# Altium schematic sheet AlarmTiming.SchDoc
size Letter; SheetNumber: 1; SheetTotal: 1
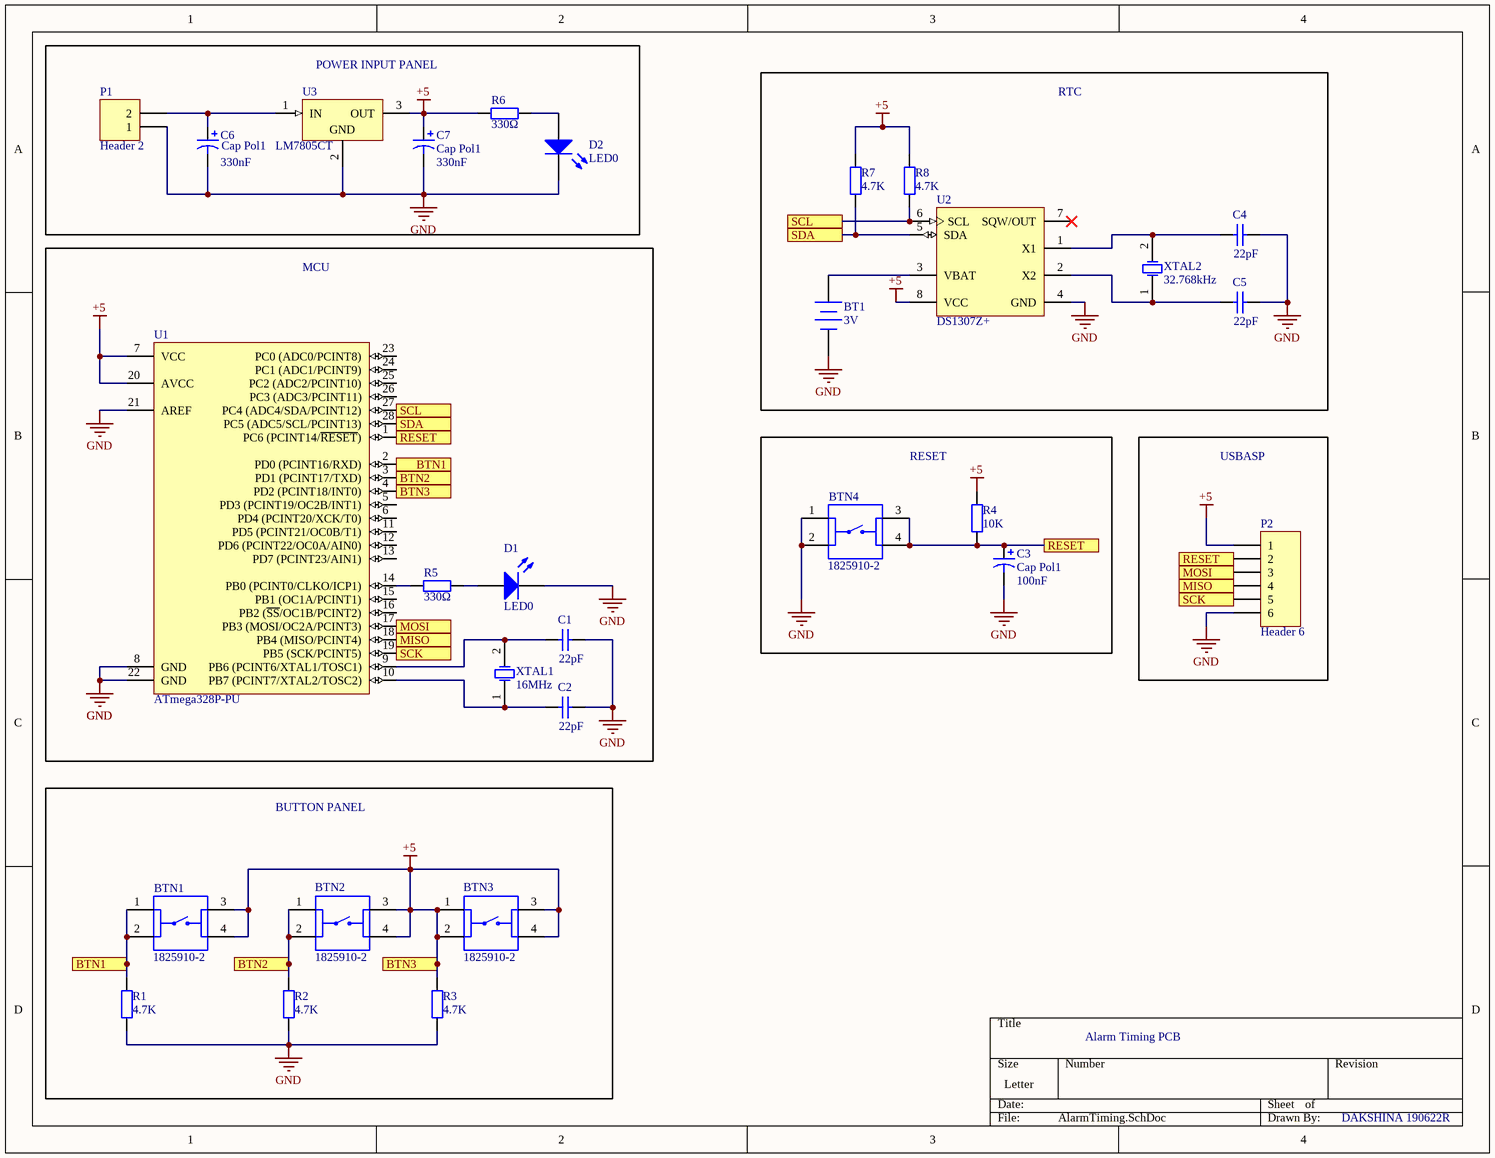
[diagram p0: AlarmTiming.SchDoc]

## Parts
BT1  3V  [BAT-2]
BTN1  1825910-2  [TE_1825910-2]
BTN2  1825910-2  [TE_1825910-2]
BTN3  1825910-2  [TE_1825910-2]
BTN4  1825910-2  [TE_1825910-2]
C1  value 22pF  [RAD-0.3]  (hidden comment: Cap)
C2  value 22pF  [RAD-0.3]  (hidden comment: Cap)
C3  Cap Pol1  value 100nF  [RB7.6-15]
C4  value 22pF  [RAD-0.3]  (hidden comment: Cap)
C5  value 22pF  [RAD-0.3]  (hidden comment: Cap)
C6  Cap Pol1  value 330nF  [RB7.6-15]
C7  Cap Pol1  value 330nF  [RB7.6-15]
D1  LED0  [LED-0]
D2  LED0  [LED-0]
P1  Header 2  [HDR1X2]
P2  Header 6  [HDR1X6]
R1  value 4.7K  [AXIAL-0.4]  (hidden comment: Res2)
R2  value 4.7K  [AXIAL-0.4]  (hidden comment: Res2)
R3  value 4.7K  [AXIAL-0.4]  (hidden comment: Res2)
R4  value 10K  [AXIAL-0.4]  (hidden comment: Res2)
R5  value 330Ω  [AXIAL-0.4]  (hidden comment: Res2)
R6  value 330Ω  [AXIAL-0.4]  (hidden comment: Res2)
R7  value 4.7K  [AXIAL-0.4]  (hidden comment: Res2)
R8  value 4.7K  [AXIAL-0.4]  (hidden comment: Res2)
U1  ATmega328P-PU  [28P3]
U2  DS1307Z+  [S8+2_L]
U3  LM7805CT  [FAIR-TO-220-3]
XTAL1  16MHz  [R38]
XTAL2  32.768kHz  [R38]

## Blocks framed on the sheet
POWER INPUT PANEL: C6 C7 D2 P1 R6 U3
RTC: BT1 C4 C5 R7 R8 U2 XTAL2
MCU: C1 C2 D1 R5 U1 XTAL1
RESET: BTN4 C3 R4
USBASP: P2
BUTTON PANEL: BTN1-BTN3 R1-R3

## Ports
BTN1, BTN2, BTN3, MISO, MOSI, RESET, SCK, SCL, SDA

## Nets
+5: BTN1.3 BTN1.4 BTN2.3 BTN2.4 BTN3.1 BTN3.2 BTN3.3 BTN3.4 C7.1 P2.1 R3.2 R4.2 R6.2 R7.2 R8.2 U1.4(PD2_(PCINT18/INT0)) U1.7(VCC) U1.20(AVCC) U2.8(VCC) U3.3(OUT) ; port BTN3
GND: BT1.2(-) BTN4.1 BTN4.2 C1.2 C2.2 C3.2 C4.2 C5.2 C6.2 C7.2 D1.2(K) D2.2(K) P1.1 P2.6 R1.1 R2.1 R3.1 U1.8(GND) U1.21(AREF) U1.22(GND) U2.4(GND) U3.2(GND)
BTN1: BTN1.1 BTN1.2 R1.2 U1.2(PD0_(PCINT16/RXD)) ; port BTN1
BTN2: BTN2.1 BTN2.2 R2.2 U1.3(PD1_(PCINT17/TXD)) ; port BTN2
MISO: P2.4 U1.18(PB4_(MISO/PCINT4)) ; port MISO
MOSI: P2.3 U1.17(PB3_(MOSI/OC2A/PCINT3)) ; port MOSI
RESET: BTN4.3 BTN4.4 C3.1 P2.2 R4.1 U1.1(PC6_(PCINT14/~{RESET})) ; port RESET
SCK: P2.5 U1.19(PB5_(SCK/PCINT5)) ; port SCK
SCL: R8.1 U1.27(PC4_(ADC4/SDA/PCINT12)) U2.6(SCL) ; port SCL
SDA: R7.1 U1.28(PC5_(ADC5/SCL/PCINT13)) U2.5(SDA) ; port SDA
NetBT1_1: BT1.1(+) U2.3(VBAT)
NetC1_1: C1.1 U1.9(PB6_(PCINT6/XTAL1/TOSC1)) XTAL1.2(OSC2)
NetC2_1: C2.1 U1.10(PB7_(PCINT7/XTAL2/TOSC2)) XTAL1.1(OSC1)
NetC4_1: C4.1 U2.1(X1) XTAL2.2(OSC2)
NetC5_1: C5.1 U2.2(X2) XTAL2.1(OSC1)
NetC6_1: C6.1 P1.2 U3.1(IN)
NetD1_1: D1.1(A) R5.1
NetD2_1: D2.1(A) R6.1
NetR5_2: R5.2 U1.14(PB0_(PCINT0/CLKO/ICP1))

Not connected (* = marked no-connect by the designer): U1 5(PD3_(PCINT19/OC2B/INT1)) 6(PD4_(PCINT20/XCK/T0)) 11(PD5_(PCINT21/OC0B/T1)) 12(PD6_(PCINT22/OC0A/AIN0)) 13(PD7_(PCINT23/AIN1)) 15(PB1_(OC1A/PCINT1)) 16(PB2_(~{SS}/OC1B/PCINT2)) 23(PC0_(ADC0/PCINT8)) 24(PC1_(ADC1/PCINT9)) 25(PC2_(ADC2/PCINT10)) 26(PC3_(ADC3/PCINT11)); U2 7(SQW/OUT)*

## Notes on the sheet
- Alarm Timing PCB
- DAKSHINA 190622R

## Library data of the parts
BT1 = Battery: Multicell Battery; Published: 24-Mar-1999; LatestRevisionDate: 17-Jul-2002; LatestRevisionNote: Re-released for DXP Platform.; PackageReference: BAT-2; Publisher: Altium Limited; PackageDescription: Battery; 2 Leads
BTN1-BTN4 = 1825910-2: 50 mA SPST Round Actuator 160 Gram Force Tactile Pushbutton Switch; Contact_Current_Rating: 50 mA; MF: TE Connectivity; Configuration_Pole-Throw: Single Pole - Single Throw; Availability: Unavailable; MP: 1825910-2; Value: *; Package: None; SnapEDA_Link: https://www.snapeda.com/parts/1825910-2/TE%20Connectivity%20ALCOSWITCH%20Switches/view-part/278983/?ref=snap; TE_purchase_URL: https://www.te.com/usa-en/product-1825910-2.html?te_bu=Cor&te_type=disp&te_campaign=seda_glo_cor-seda-global-disp-prtnr-fy19-seda-model-bom-cta_sma-317_1&elqCampaignId=32493; EU_RoHS_Compliance: Compliant; Price: None
C1 C2 C4 C5 = Cap: Capacitor; Published: 8-Jun-2000; LatestRevisionDate: 17-Jul-2002; LatestRevisionNote: Re-released for DXP Platform.; PackageReference: RAD-0.3; Publisher: Altium Limited; PackageDescription: Radial Cap, Thru-Hole; 2 Leads; 0.3 in Pin Spacing
C3 C6 C7 = Cap Pol1: Polarized Capacitor (Radial); Published: 8-Jun-2000; LatestRevisionDate: 17-Jul-2002; LatestRevisionNote: Re-released for DXP Platform.; PackageReference: RB7.6-15; Publisher: Altium Limited; PackageDescription: Polarized Capacitor (Radial); 2 Leads
D1 D2 = LED0: Typical INFRARED GaAs LED; Published: 8-Jun-2000; LatestRevisionDate: 08-Jul-2005; LatestRevisionNote: Mech Layer 1 removed.; PackageReference: LED-0; Publisher: Altium Limited; PackageDescription: LED; 2 Leads
P1 = Header 2: Header, 2-Pin; LatestRevisionDate: 17-Jul-2002; LatestRevisionNote: Re-released for DXP Platform.; Publisher: Altium Limited
P2 = Header 6: Header, 6-Pin; LatestRevisionDate: 17-Jul-2002; LatestRevisionNote: Re-released for DXP Platform.; Publisher: Altium Limited
R1-R8 = Res2: Resistor; Published: 8-Jun-2000; LatestRevisionDate: 17-Jul-2002; LatestRevisionNote: Re-released for DXP Platform.; PackageReference: AXIAL-0.4; Publisher: Altium Limited; PackageDescription: Axial Device, Thru-Hole; 2 Leads; 0.4 in Pin Spacing
U1 = CMP-0095-00013-2: 8-bit AVR Microcontroller, 32KB Flash, 1KB EEPROM, 2KB SRAM, 28-pin PDIP, Industrial Grade (-40°C to 85°C); RevisionNote: DatasheetVersion updated. URLs added.; PackageVersion: revB, Sep-2001; PackageDescription: 28-lead (0.300"/7.62mm Wide) Plastic Dual Inline Package (PDIP); DatasheetVersion: revD, May-2011; ComponentLink1Description: Manufacturer URL; ComponentLink1URL: http://www.atmel.com/; PackageReference: 28P3; ComponentLink2Description: ATmega48A/48PA/88A/88PA/168A/168PA/328/328P Datasheet; ComponentLink3URL: http://www.atmel.com/dyn/resources/prod_documents/8271S.pdf; ComponentLink2URL: http://www.atmel.com/dyn/resources/prod_documents/8271.pdf; ComponentLink3Description: ATmega48A/48PA/88A/88PA/168A/168PA/328/328P Summary
U2 = CMP-0254-00308-1: 64 x 8, Serial, I2C Real-Time Clock, 5.0V, 8-Pin SO, 0 to 70 degC, Pb-Free; ComponentLink3Description: Package Specification; DatasheetVersion: 10-Feb-2008; Code_IPC: SOIC127P600-8; ComponentLink2Description: Datasheet; Code_JEDEC: MS-012-AA; ComponentLink2URL: http://datasheets.maxim-ic.com/en/ds/DS1307.pdf; ComponentLink3URL: http://pdfserv.maxim-ic.com/package_dwgs/21-0041.PDF; ComponentLink1URL: http://www.maxim-ic.com; PackageReference: S8+2; ComponentLink1Description: Manufacturer URL; PackageDescription: 8-Pin Small-Outline IC, Narrow (0.15in), 1.27 mm Pitch, SOIC (N), Pb-Free; PackageVersion: revC, 2010
U3 = CMP-2000-04938-1: Positive Voltage Regulator, 5 V, 1 A, -40 to 125 degC, 3-Pin TO-220, RoHS, Tube; Manufacturer: FairchildSemiconductor; Maximum Input Voltage: 35V; Maximum Quiescent Current: 8mA; Load Regulation: 100mV; Maximum Output Current: 2.2(Typ)A; Output Type: Fixed; Typical Dropout Voltage @ Current: 2@1AV; Rad Hard: No; Output Voltage: 5V; Accuracy: ±4%; Number of Outputs: 1; Category: LinearRegulator; Package Description: 3-Pin Through Hole Device, Body 10 x 4.5 mm, Pitch 2.54 mm; Packaging: Rail/Tube; Mounting: ThroughHole; Polarity: Positive; Manufacturer URL: https://www.fairchildsemi.com/; Line Regulation: 100mV; Datasheet Version: Aug-12; Datasheet URL: https://datasheet.ciiva.com/26904/lm7805ct-26904988.pdf; Package Reference: TO-220; Package URL: https://www.fairchildsemi.com/package-drawings/TO/TO220B03.pdf; Package: 3TO-220AB; Operating Temperature: -40to125degC; Type: Linear
XTAL1 XTAL2 = XTAL: Crystal Oscillator; Published: 8-Jun-2000; LatestRevisionDate: 17-Jul-2002; LatestRevisionNote: Re-released for DXP Platform.; PackageReference: R38; Publisher: Altium Limited; PackageDescription: Crystal, Thru-Hole; 2 Leads; Body 3.1 x 8.2 mm (Dia.xH)